# Altium schematic sheet Driving Circuits.SchDoc
size A4; SheetNumber: 2; SheetTotal: 2
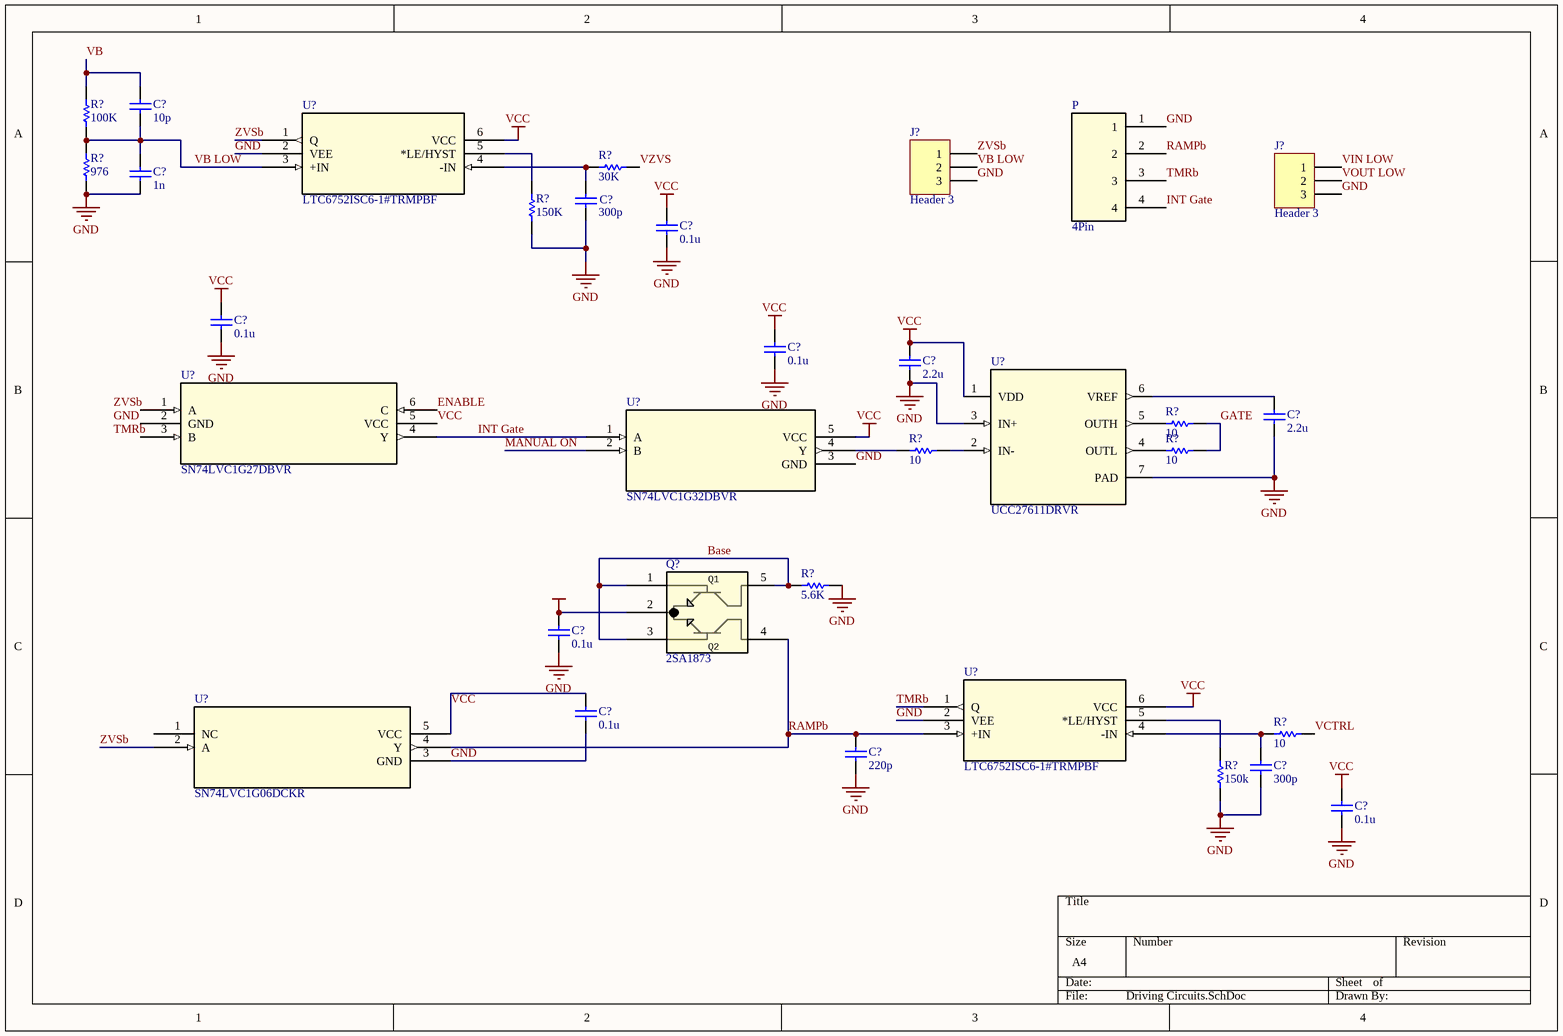
[diagram p0: Driving Circuits.SchDoc]

## Parts
(Parts that share a designator on the sheet are numbered #1, #2 ... from top to bottom, then left to right.)
C?#1  value 10p  (hidden comment: Capacitor)
C?#2  value 1n  (hidden comment: Capacitor)
C?#3  value 300p  (hidden comment: Capacitor)
C?#4  value 0.1u  (hidden comment: Capacitor)
C?#5  value 0.1u  (hidden comment: Capacitor)
C?#6  value 0.1u  (hidden comment: Capacitor)
C?#7  value 2.2u  (hidden comment: Capacitor)
C?#8  value 2.2u  (hidden comment: Capacitor)
C?#9  value 0.1u  (hidden comment: Capacitor)
C?#10  value 0.1u  (hidden comment: Capacitor)
C?#11  value 220p  (hidden comment: Capacitor)
C?#12  value 300p  (hidden comment: Capacitor)
C?#13  value 0.1u  (hidden comment: Capacitor)
J?#1  Header 3  [3_test_pin]
J?#2  Header 3  [3_test_pin]
P  4Pin  [4 pin Terminal - pitch 2.54mm]
Q?  2SA1873  [SOT-353_USV_TOS]
R?#1  value 100K  (hidden comment: Resistor)
R?#2  value 30K  (hidden comment: Resistor)
R?#3  value 150K  (hidden comment: Resistor)
R?#4  value 976  (hidden comment: Resistor)
R?#5  value 10  (hidden comment: Resistor)
R?#6  value 10  (hidden comment: Resistor)
R?#7  value 10  (hidden comment: Resistor)
R?#8  value 5.6K  (hidden comment: Resistor)
R?#9  value 10  (hidden comment: Resistor)
R?#10  value 150k  (hidden comment: Resistor)
U?#1  LTC6752ISC6-1#TRMPBF  [SC70-SC6_LIT]
U?#2  SN74LVC1G27DBVR  [DBV6]
U?#3  SN74LVC1G32DBVR  [DBV5]
U?#4  UCC27611DRVR  [DRV0006A]
U?#5  LTC6752ISC6-1#TRMPBF  [SC70-SC6_LIT]
U?#6  SN74LVC1G06DCKR  [DCK5]

## Nets
GND: C?#2.1 C?#3.1 C?#4.1 C?#5.1 C?#6.1 C?#7.1 C?#8.1 C?#9.1 C?#10.1 C?#11.1 C?#12.1 C?#13.1 J?#1.3 J?#2.3 P.1 R?#3.2 R?#4.1 R?#8.2 R?#10.1 U?#1.2(VEE) U?#3.3(GND) U?#4.3(IN+) U?#4.7(PAD) U?#5.2(VEE) U?#6.3(GND)
NetC?#9_2: C?#9.2 Q?.2(EMITTER)
VCC: C?#4.2 C?#5.2 C?#6.2 C?#7.2 C?#10.2 C?#13.2 U?#1.6(VCC) U?#2.5(VCC) U?#3.5(VCC) U?#4.1(VDD) U?#5.6(VCC) U?#6.5(VCC)
Base: Q?.1(BASE1) Q?.3(BASE2) Q?.5(COLLECTOR1) R?#8.1
ENABLE: U?#2.6(C)
GATE: R?#5.1 R?#7.1
INT Gate: P.4 U?#2.4(Y) U?#3.1(A)
MANUAL ON: U?#3.2(B)
RAMPb: C?#11.2 P.2 Q?.4(COLLECTOR2) U?#5.3(+IN) U?#6.4(Y)
TMRb: P.3 U?#5.1(Q)
VB: C?#1.2 R?#1.2
VB LOW: C?#1.1 C?#2.2 J?#1.2 R?#1.1 R?#4.2 U?#1.3(+IN)
VCTRL: R?#9.1
VIN LOW: J?#2.1
VOUT LOW: J?#2.2
VZVS: R?#2.1
ZVSb: J?#1.1 U?#1.1(Q) U?#6.2(A)
NetC?#3_2: C?#3.2 R?#2.2 U?#1.4(-IN)
NetC?#8_2: C?#8.2 U?#4.6(VREF)
NetC?#12_2: C?#12.2 R?#9.2 U?#5.4(-IN)
NetR?#3_1: R?#3.1 U?#1.5(*LE/HYST)
NetR?#5_2: R?#5.2 U?#4.5(OUTH)
NetR?#6_1: R?#6.1 U?#4.2(IN-)
NetR?#6_2: R?#6.2 U?#3.4(Y)
NetR?#7_2: R?#7.2 U?#4.4(OUTL)
NetR?#10_2: R?#10.2 U?#5.5(*LE/HYST)

Not connected (* = marked no-connect by the designer): U?#2 1(A) 2(GND) 3(B); U?#6 1(NC)

## Notes on the sheet
- Labels drawn without touching a wire or pin: GND, TMRb, ZVSb
- (in symbol 2SA1873) Q1; Q2

## Library data of the parts
C?#1-C?#13 = Capacitor: SimulationGenericComponent: True
J?#1 J?#2 = Header 3: Header, 3-Pin; LatestRevisionDate: 17-Jul-2002; LatestRevisionNote: Re-released for DXP Platform.; Publisher: Altium Limited
P = 4 pin Terminal: ComponentLink1: http://www.digikey.com/product-detail/en/te-connectivity-amp-connectors/3-644456-6/A31116-ND/698348
Q? = 2SA1873: PNP + PNP Bipolar Transistor, -50 V, -0.15 A, SOT-353(USV); Manufacturer_Name: Toshiba Electronic Devices & Storage Corp.; Copyright: Copyright (C) 2025 Ultra Librarian. All rights reserved.; Manufacturer_Part_Number: 2SA1873; RefDes: RefDes; Type: Type
R?#1-R?#10 = Resistor: TC1: 0; SimulationGenericComponent: True; TC2: 0
U?#1 U?#5 = LTC6752ISC6-1TRMPBF: 280MHz, 2.9ns Comparator Family with Rail-to-Rail Inputs and CMOS Outputs; Manufacturer_Name: Analog Devices Inc; Copyright: Copyright (C) 2025 Ultra Librarian. All rights reserved.; Manufacturer_Part_Number: LTC6752ISC6-1#TRMPBF; Datasheet: https://www.analog.com/media/en/technical-documentation/data-sheets/6752fc.pdf; RefDes: RefDes; Type: Type
U?#2 = SN74LVC1G27DBVR: Single 3-input, 1.65-V to 5.5-V NOR gate 6-SOT-23 -40 to 125; Manufacturer_Name: Texas Instruments; Copyright: Copyright (C) 2025 Ultra Librarian. All rights reserved.; Manufacturer_Part_Number: SN74LVC1G27DBVR; RefDes: RefDes; Type: Type
U?#3 = SN74LVC1G32DBVR: 1-ch, 2-input 1.65-V to 5.5-V 32-mA drive strength OR gate 5-SOT-23 -40 to 125; Manufacturer_Name: Texas Instruments; Copyright: Copyright (C) 2025 Ultra Librarian. All rights reserved.; Manufacturer_Part_Number: SN74LVC1G32DBVR; RefDes: RefDes; Type: Type
U?#4 = UCC27611DRVR: 4-A/6-A single-channel gate driver with 4-V UVLO and 5-V regulated output 6-WSON -40 to 140; Manufacturer_Name: Texas Instruments; CompType: IC; TYPE: TYPE; RefDes: RefDes; Copyright: Copyright (C) 2025 Ultra Librarian. All rights reserved.; Manufacturer_Part_Number: UCC27611DRVR; Application_BuildNumber: *; PartNumber: UCC27611DRVR; PackageReference: DRV0006A; MountType: SMT; RoHS: Y; Manufacturer: Texas Instruments
U?#6 = SN74LVC1G06DCKR: Single 1.65-V to 5.5-V inverter with open-drain outputs 5-SC70 -40 to 125; Manufacturer_Name: Texas Instruments; Copyright: Copyright (C) 2025 Ultra Librarian. All rights reserved.; Manufacturer_Part_Number: SN74LVC1G06DCKR; Datasheet: https://www.ti.com/lit/gpn/sn74lvc1g06; RefDes: RefDes; Type: Type